# EAGLE design cm_AD8629 (EAGLE 8.5.0)

## Sheet 1 of 2
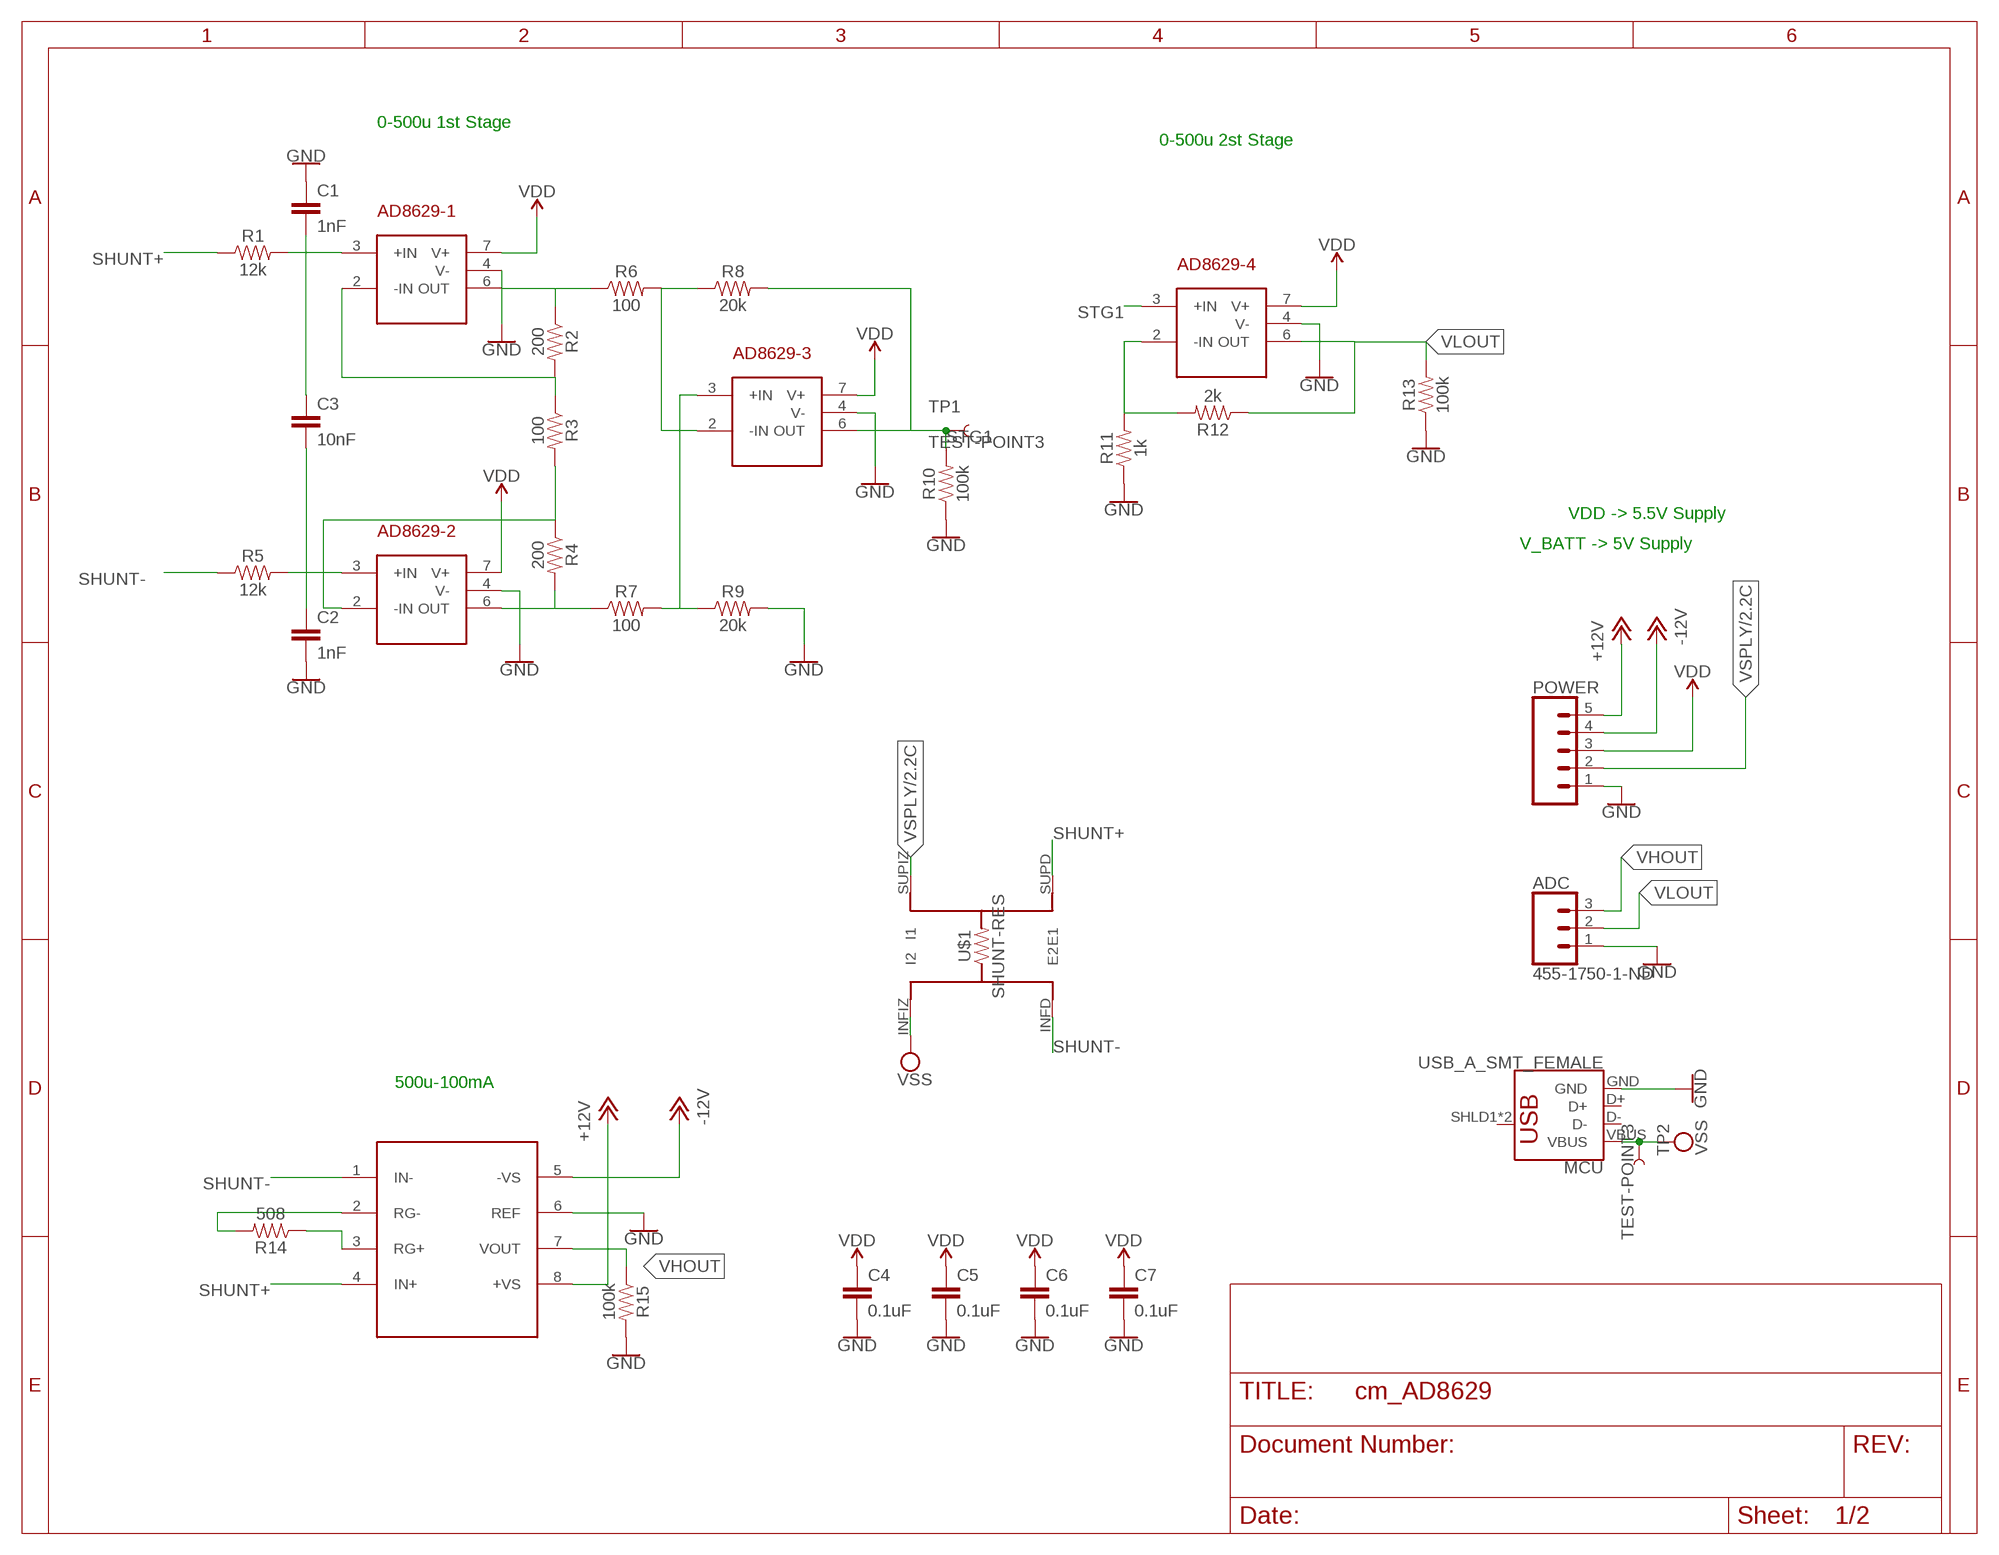
[diagram p0: schematic, sheet 1, part 1 of 2]
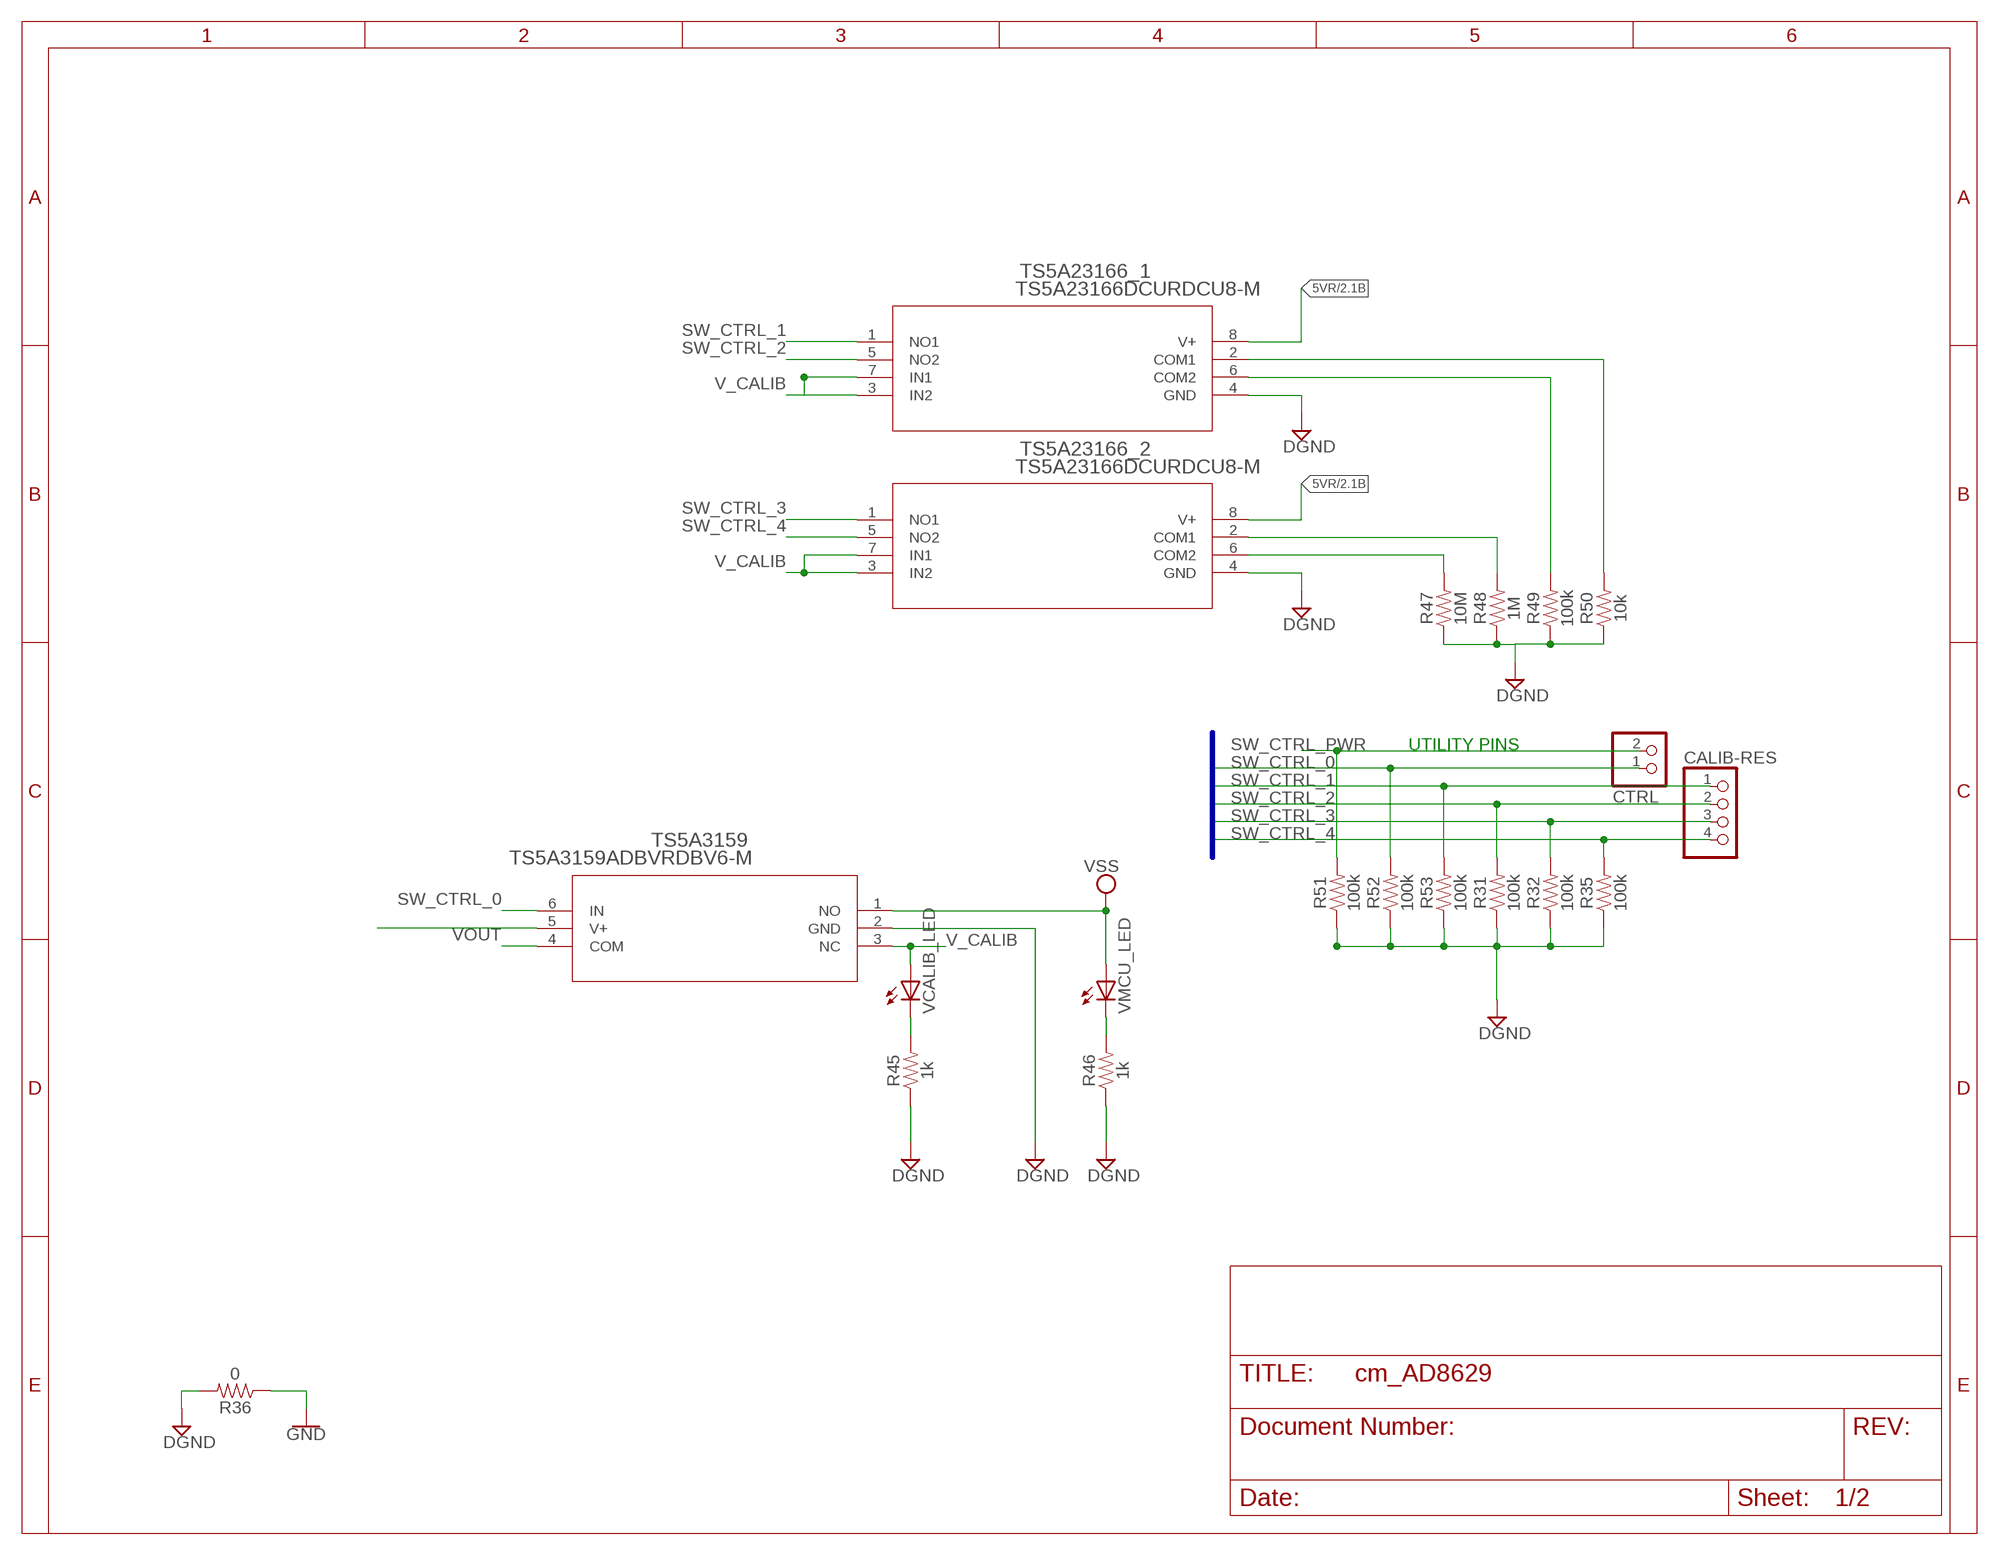
[diagram p1: schematic, sheet 1, part 2 of 2]

### Parts
AD8422  AD8422  [SO08]
AD8629-1  AD8629  [SO08]
AD8629-2  AD8629  [SO08]
AD8629-3  AD8629  [SO08]
AD8629-4  AD8629  [SO08]
ADC  455-1750-1-ND  CONN_03  [1X03]
C1  1nF  3.0NF-0603-50V-5%  [0603]
C2  1nF  3.0NF-0603-50V-5%  [0603]
C3  10nF  3.0NF-0603-50V-5%  [0603]
C4  0.1uF  3.0NF-0603-50V-5%  [0603]
C5  0.1uF  3.0NF-0603-50V-5%  [0603]
C6  0.1uF  3.0NF-0603-50V-5%  [0603]
C7  0.1uF  3.0NF-0603-50V-5%  [0603]
CALIB-RES  PINHD-1X4  [1X04]
CTRL  PINHD-1X2  [1X02]
MCU  USB_A_SMT_FEMALE  [USB-A-S-SILK-FEMALE]
POWER  CONN_05  [1X05]
R1  12k  8.2KOHM-0603-1/10W-5%  [0603]
R2  200  8.2KOHM-0603-1/10W-5%  [0603]
R3  100  8.2KOHM-0603-1/10W-5%  [0603]
R4  200  8.2KOHM-0603-1/10W-5%  [0603]
R5  12k  8.2KOHM-0603-1/10W-5%  [0603]
R6  100  8.2KOHM-0603-1/10W-5%  [0603]
R7  100  8.2KOHM-0603-1/10W-5%  [0603]
R8  20k  8.2KOHM-0603-1/10W-5%  [0603]
R9  20k  8.2KOHM-0603-1/10W-5%  [0603]
R10  100k  8.2KOHM-0603-1/10W-5%  [0603]
R11  1k  8.2KOHM-0603-1/10W-5%  [0603]
R12  2k  8.2KOHM-0603-1/10W-5%  [0603]
R13  100k  8.2KOHM-0603-1/10W-5%  [0603]
R14  508  8.2KOHM-0603-1/10W-5%  [0603]
R15  100k  8.2KOHM-0603-1/10W-5%  [0603]
R31  100k  8.2KOHM-0603-1/10W-5%  [0603]
R32  100k  8.2KOHM-0603-1/10W-5%  [0603]
R35  100k  8.2KOHM-0603-1/10W-5%  [0603]
R36  0  8.2KOHM-0603-1/10W-5%  [0603]
R45  1k  8.2KOHM-0603-1/10W-5%  [0603]
R46  1k  8.2KOHM-0603-1/10W-5%  [0603]
R47  10M  8.2KOHM-0603-1/10W-5%  [0603]
R48  1M  8.2KOHM-0603-1/10W-5%  [0603]
R49  100k  8.2KOHM-0603-1/10W-5%  [0603]
R50  10k  8.2KOHM-0603-1/10W-5%  [0603]
R51  100k  8.2KOHM-0603-1/10W-5%  [0603]
R52  100k  8.2KOHM-0603-1/10W-5%  [0603]
R53  100k  8.2KOHM-0603-1/10W-5%  [0603]
TP1  TEST-POINT3  [PAD.03X.03]
TP2  TEST-POINT3  [PAD.03X.03]
TS5A3159  TS5A3159ADBVRDBV6-M  [DBV6-M]
TS5A23166_1  TS5A23166DCURDCU8-M  [DCU8-M]
TS5A23166_2  TS5A23166DCURDCU8-M  [DCU8-M]
U$1  SHUNT-RES  [HIPREC-SMD-SHUNT]
VCALIB_LED  LEDCHIPLED_0603  [CHIPLED_0603]
VMCU_LED  LEDCHIPLED_0603  [CHIPLED_0603]

### Nets
5V_F: TS5A3159.5(V+)
5VR: TS5A23166_1.8(V+) TS5A23166_2.8(V+) ; also sheet 2
+12V: AD8422.8(+VS) POWER.5 ; also sheet 2
-12V: AD8422.5(-VS) POWER.4 ; also sheet 2
DGND: R31.1 R32.1 R35.1 R36.2 R45.1 R46.1 R47.1 R48.1 R49.1 R50.1 R51.1 R52.1 R53.1 TS5A3159.2(GND) TS5A23166_1.4(GND) TS5A23166_2.4(GND) ; also sheet 2
GND: AD8422.6(REF) AD8629-1.4(V-) AD8629-2.4(V-) AD8629-3.4(V-) AD8629-4.4(V-) ADC.1 C1.1 C2.2 C4.2 C5.2 C6.2 C7.2 MCU.GND POWER.1 R9.2 R10.1 R11.1 R13.1 R15.2 R36.1 ; also sheet 2
N$1: AD8629-2.3(+IN) C2.1 C3.2 R5.2
N$2: AD8629-1.6(OUT) R2.1 R6.1
N$3: AD8629-1.2(-IN) R2.2 R3.1
N$4: AD8629-2.2(-IN) R3.2 R4.1
N$5: AD8629-2.6(OUT) R4.2 R7.1
N$6: AD8629-1.3(+IN) C1.2 C3.1 R1.2
N$7: AD8422.2(RG-) R14.2
N$8: AD8629-3.2(-IN) R6.2 R8.1
N$9: AD8629-3.3(+IN) R7.2 R9.1
N$10: AD8422.3(RG+) R14.1
N$17: AD8629-4.2(-IN) R11.2 R12.2
N$23: R45.2 VCALIB_LED.C
N$24: R46.2 VMCU_LED.C
N$30: R50.2 TS5A23166_1.2(COM1)
N$31: R49.2 TS5A23166_1.6(COM2)
N$32: R48.2 TS5A23166_2.2(COM1)
N$33: R47.2 TS5A23166_2.6(COM2)
SHUNT+: AD8422.4(IN+) R1.1 U$1.SUPD(E1)
SHUNT-: AD8422.1(IN-) R5.1 U$1.INFD(E2)
STG1: AD8629-3.6(OUT) AD8629-4.3(+IN) R8.2 R10.2 TP1.P$1
SW_CTRL_0: CTRL.1 R52.2 TS5A3159.6(IN)
SW_CTRL_1: CALIB-RES.1 R53.2 TS5A23166_1.1(NO1)
SW_CTRL_2: CALIB-RES.2 R31.2 TS5A23166_1.5(NO2)
SW_CTRL_3: CALIB-RES.3 R32.2 TS5A23166_2.1(NO1)
SW_CTRL_4: CALIB-RES.4 R35.2 TS5A23166_2.5(NO2)
SW_CTRL_PWR: CTRL.2 R51.2 ; also sheet 2
V_CALIB: TS5A3159.3(NC) TS5A23166_1.3(IN2) TS5A23166_1.7(IN1) TS5A23166_2.3(IN2) TS5A23166_2.7(IN1) VCALIB_LED.A
VDD: AD8629-1.7(V+) AD8629-2.7(V+) AD8629-3.7(V+) AD8629-4.7(V+) C4.1 C5.1 C6.1 C7.1 POWER.3 ; also sheet 2
VHOUT: AD8422.7(VOUT) ADC.3 R15.1
VLOUT: AD8629-4.6(OUT) ADC.2 R12.1 R13.2
VOUT: TS5A3159.4(COM)
VSPLY: POWER.2 U$1.SUPIZ(I1) ; also sheet 2
VSS: MCU.VBUS TP2.P$1 TS5A3159.1(NO) U$1.INFIZ(I2) VMCU_LED.A
Unconnected: MCU.D+ MCU.D- MCU.SHLD1(SHIELD) MCU.SHLD2(SHIELD)

### Buses
SWITCH_CTRL_[1..6]

### Notes on the sheet
- 0-500u 1st Stage
- 0-500u 2st Stage
- VDD -> 5.5V Supply
- V_BATT -> 5V Supply
- UTILITY PINS
- 500u-100mA

## Sheet 2 of 2
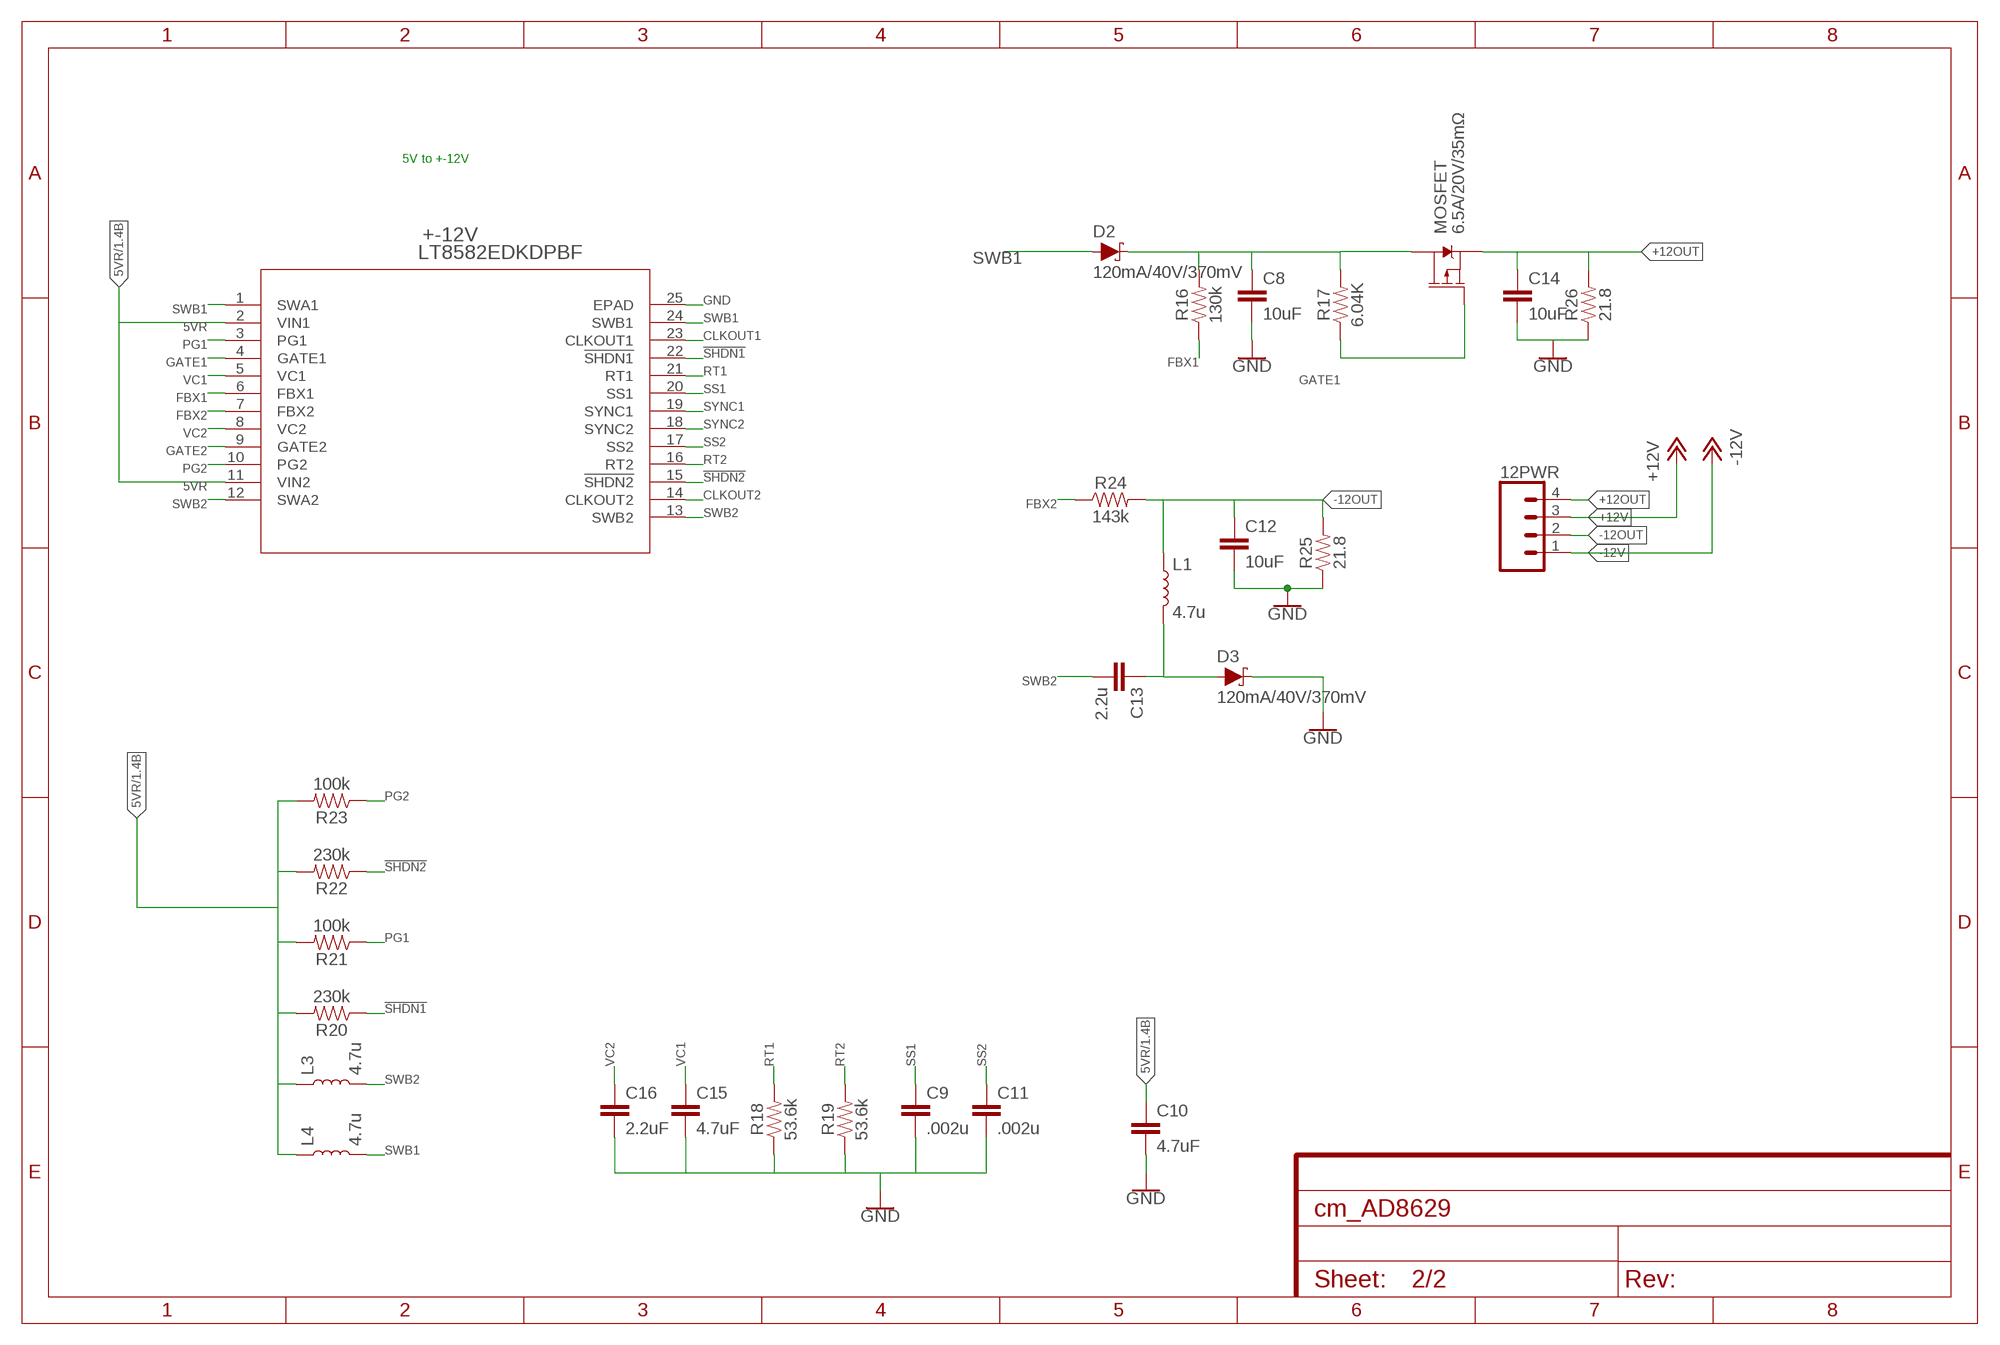
[diagram p2: schematic, sheet 2, part 1 of 2]
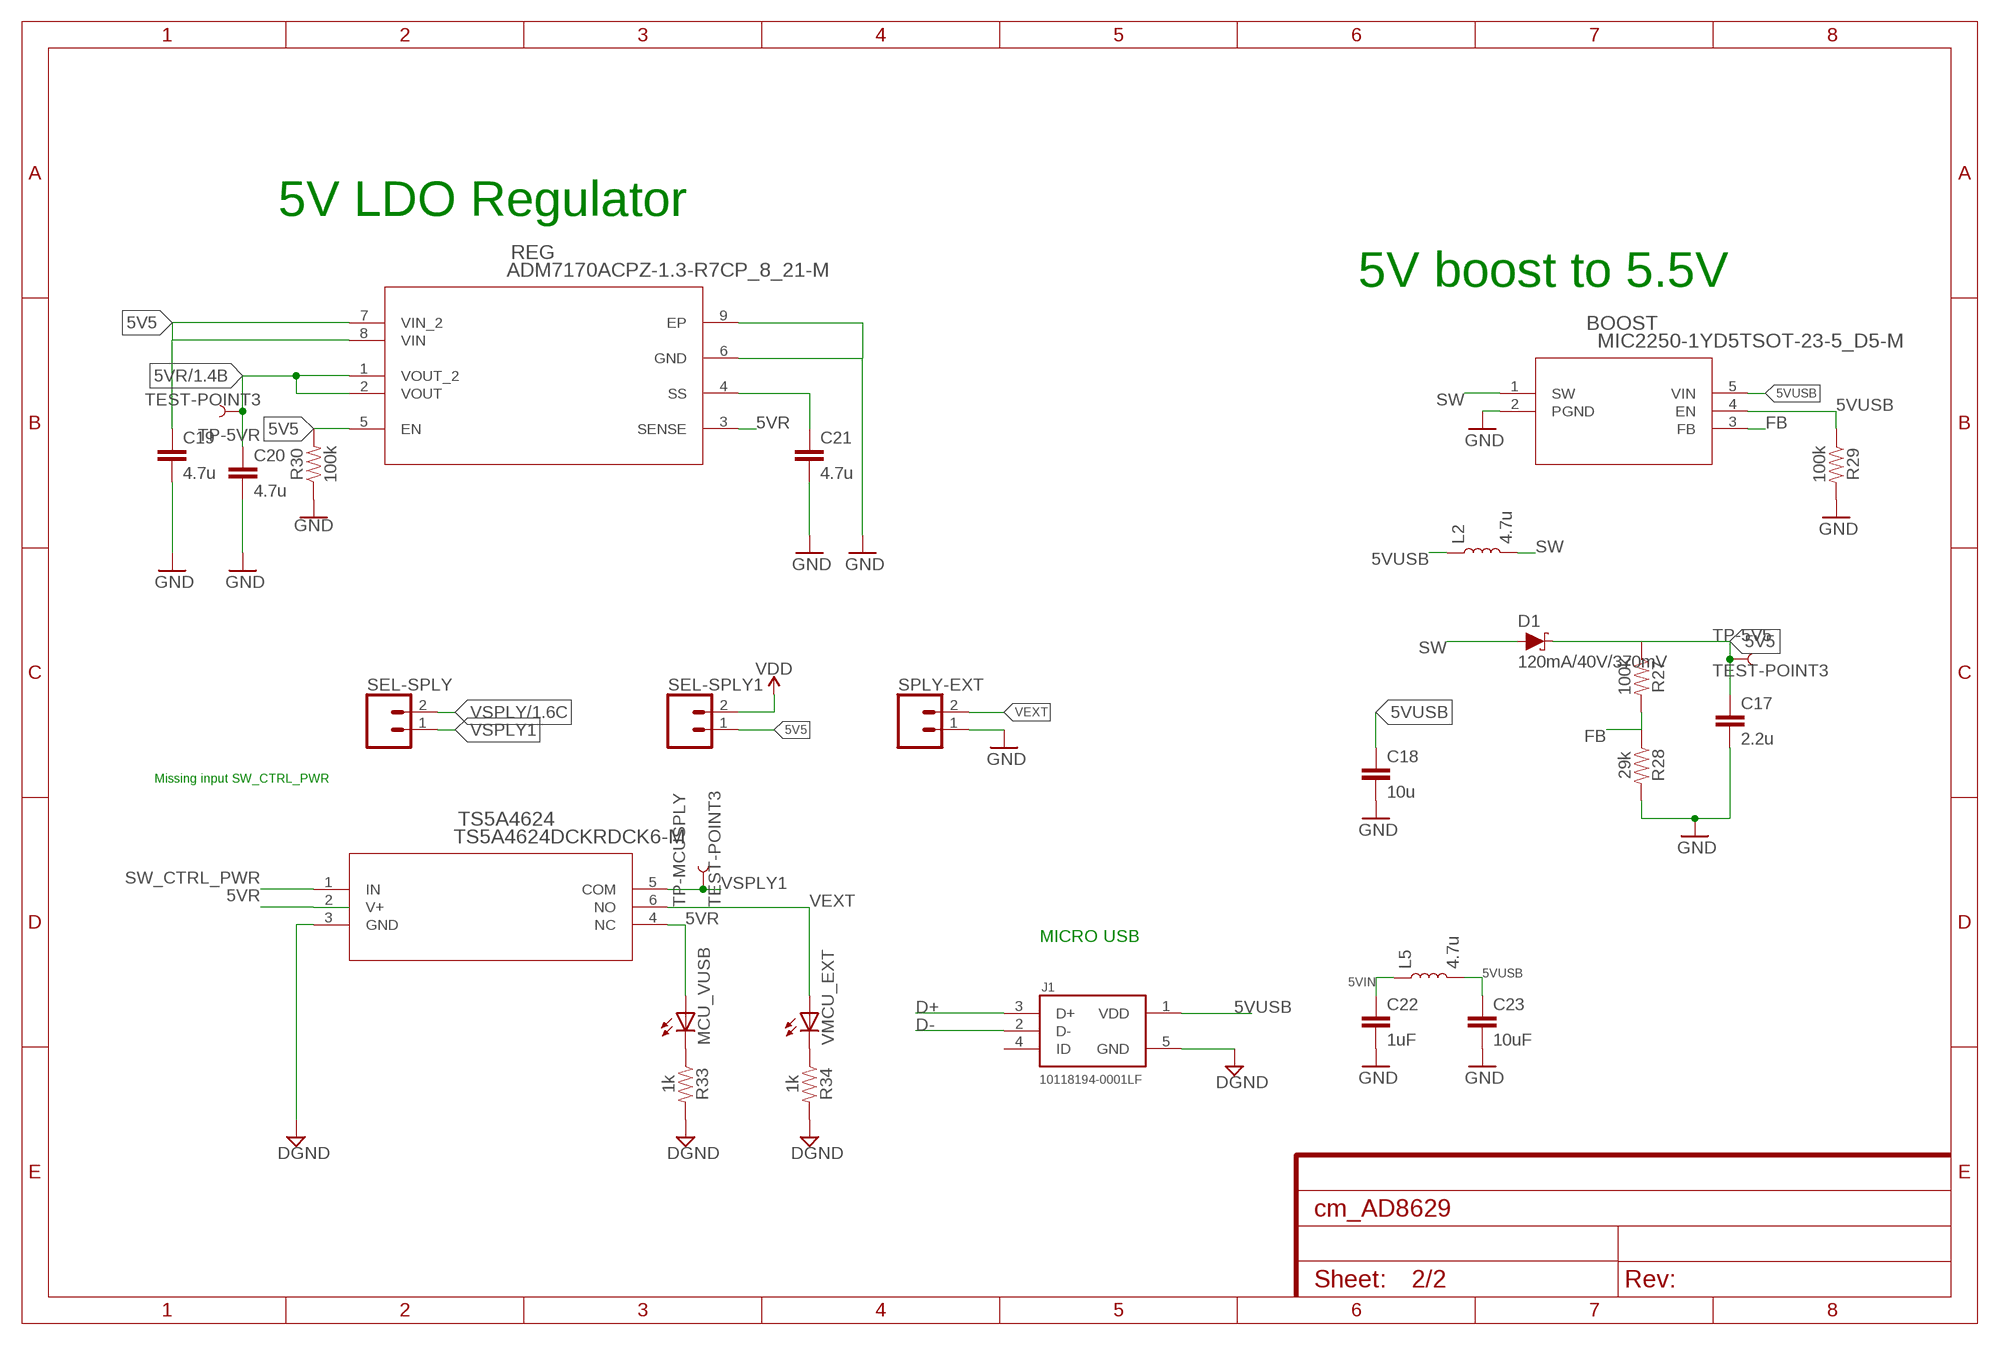
[diagram p3: schematic, sheet 2, part 2 of 2]

### Parts
12PWR  CONN_04  [1X04]
+-12V  LT8582EDKDPBF  [DFN-24_DKD]
BOOST  MIC2250-1YD5TSOT-23-5_D5-M  [TSOT-23-5_D5-M]
C8  10uF  10UF-0603-6.3V-20%  [0603]
C9  .002u  10UF-0603-6.3V-20%  [0603]
C10  4.7uF  10UF-0603-6.3V-20%  [0603]
C11  .002u  10UF-0603-6.3V-20%  [0603]
C12  10uF  10UF-0603-6.3V-20%  [0603]
C13  2.2u  10UF-0603-6.3V-20%  [0603]
C14  10uF  10UF-0603-6.3V-20%  [0603]
C15  4.7uF  10UF-0603-6.3V-20%  [0603]
C16  2.2uF  10UF-0603-6.3V-20%  [0603]
C17  2.2u  10UF-0603-6.3V-20%  [0603]
C18  10u  10UF-0603-6.3V-20%  [0603]
C19  4.7u  10UF-0603-6.3V-20%  [0603]
C20  4.7u  10UF-0603-6.3V-20%  [0603]
C21  4.7u  10UF-0603-6.3V-20%  [0603]
C22  1uF  10UF-0603-6.3V-20%  [0603]
C23  10uF  10UF-0603-6.3V-20%  [0603]
D1  120mA/40V/370mV  DIODE-SCHOTTKY-RB751S40  [SOD-523]
D2  120mA/40V/370mV  DIODE-SCHOTTKY-RB751S40  [SOD-523]
D3  120mA/40V/370mV  DIODE-SCHOTTKY-RB751S40  [SOD-523]
J1  10118194-0001LF  [FRAMATOME_10118194-0001LF]
L1  4.7u  1239AS-H  [252012C]
L2  4.7u  1239AS-H  [252012C]
L3  4.7u  1239AS-H  [252012C]
L4  4.7u  1239AS-H  [252012C]
L5  4.7u  1239AS-H  [252012C]
MCU_VUSB  LEDCHIPLED_0603  [CHIPLED_0603]
MOSFET  6.5A/20V/35mΩ  MOSFET_PCH-NDS8434  [SO08]
R16  130k  150KOHM-0603-1/10W-1%  [0603]
R17  6.04K  150KOHM-0603-1/10W-1%  [0603]
R18  53.6k  150KOHM-0603-1/10W-1%  [0603]
R19  53.6k  150KOHM-0603-1/10W-1%  [0603]
R20  230k  150KOHM-0603-1/10W-1%  [0603]
R21  100k  150KOHM-0603-1/10W-1%  [0603]
R22  230k  150KOHM-0603-1/10W-1%  [0603]
R23  100k  150KOHM-0603-1/10W-1%  [0603]
R24  143k  150KOHM-0603-1/10W-1%  [0603]
R25  21.8  150KOHM-0603-1/10W-1%  [0603]
R26  21.8  150KOHM-0603-1/10W-1%  [0603]
R27  100k  150KOHM-0603-1/10W-1%  [0603]
R28  29k  150KOHM-0603-1/10W-1%  [0603]
R29  100k  150KOHM-0603-1/10W-1%  [0603]
R30  100k  150KOHM-0603-1/10W-1%  [0603]
R33  1k  150KOHM-0603-1/10W-1%  [0603]
R34  1k  150KOHM-0603-1/10W-1%  [0603]
REG  ADM7170ACPZ-1.3-R7CP_8_21-M  [CP_8_21-M]
SEL-SPLY  CONN_02  [1X02]
SEL-SPLY1  CONN_02  [1X02]
SPLY-EXT  CONN_02  [1X02]
TP-5V5  TEST-POINT3  [PAD.03X.03]
TP-5VR  TEST-POINT3  [PAD.03X.03]
TP-MCUSPLY  TEST-POINT3  [PAD.03X.03]
TS5A4624  TS5A4624DCKRDCK6-M  [DCK6-M]
VMCU_EXT  LEDCHIPLED_0603  [CHIPLED_0603]

### Nets
5V5: C17.1 C19.1 D1.C R27.1 R30.2 REG.5(EN) REG.7(VIN_2) REG.8(VIN) SEL-SPLY1.1 TP-5V5.P$1
5VIN: C22.1 L5.1
5VR: +-12V.2(VIN1) +-12V.11(VIN2) C10.1 C20.1 L3.1 L4.1 MCU_VUSB.A R20.2 R21.2 R22.2 R23.2 REG.1(VOUT_2) REG.2(VOUT) REG.3(SENSE) TP-5VR.P$1 TS5A4624.2(V+) TS5A4624.4(NC) ; also sheet 1
5VUSB: BOOST.4(EN) BOOST.5(VIN) C18.1 C23.1 J1.1(VDD) L2.1 L5.2 R29.1
!SHDN1: +-12V.22(!SHDN1) R20.1
!SHDN2: +-12V.15(!SHDN2) R22.1
+12OUT: 12PWR.4 C14.1 MOSFET.1(S) MOSFET.2(S) MOSFET.3(S) R26.2
+12V: 12PWR.3 ; also sheet 1
-12OUT: 12PWR.2 C12.1 L1.1 R24.2 R25.2
-12V: 12PWR.1 ; also sheet 1
CLKOUT1: +-12V.23(CLKOUT1)
CLKOUT2: +-12V.14(CLKOUT2)
D+: J1.3(D+)
D-: J1.2(D-)
DGND: J1.5(GND) R33.2 R34.2 TS5A4624.3(GND) ; also sheet 1
FB: BOOST.3(FB) R27.2 R28.1
FBX1: +-12V.6(FBX1) R16.1
FBX2: +-12V.7(FBX2) R24.1
GATE1: +-12V.4(GATE1) MOSFET.4(G) R17.1
GATE2: +-12V.9(GATE2)
GND: +-12V.25(EPAD) BOOST.2(PGND) C8.2 C9.2 C10.2 C11.2 C12.2 C14.2 C15.2 C16.2 C17.2 C18.2 C19.2 C20.2 C21.2 C22.2 C23.2 D3.C R18.1 R19.1 R25.1 R26.1 R28.2 R29.2 R30.1 REG.6(GND) REG.9(EP) SPLY-EXT.1 ; also sheet 1
N$12: MCU_VUSB.C R33.1
N$13: C8.1 D2.C MOSFET.5(D) MOSFET.6(D) MOSFET.7(D) MOSFET.8(D) R16.2 R17.2
N$14: C13.1 D3.A L1.2
N$19: R34.1 VMCU_EXT.C
N$20: C21.1 REG.4(SS)
PG1: +-12V.3(PG1) R21.1
PG2: +-12V.10(PG2) R23.1
RT1: +-12V.21(RT1) R18.2
RT2: +-12V.16(RT2) R19.2
SS1: +-12V.20(SS1) C9.1
SS2: +-12V.17(SS2) C11.1
SW: BOOST.1(SW) D1.A L2.2
SW_CTRL_PWR: TS5A4624.1(IN) ; also sheet 1
SWB1: +-12V.1(SWA1) +-12V.24(SWB1) D2.A L4.2
SWB2: +-12V.12(SWA2) +-12V.13(SWB2) C13.2 L3.2
SYNC1: +-12V.19(SYNC1)
SYNC2: +-12V.18(SYNC2)
VC1: +-12V.5(VC1) C15.1
VC2: +-12V.8(VC2) C16.1
VDD: SEL-SPLY1.2 ; also sheet 1
VEXT: SPLY-EXT.2 TS5A4624.6(NO) VMCU_EXT.A
VSPLY: SEL-SPLY.2 ; also sheet 1
VSPLY1: SEL-SPLY.1 TP-MCUSPLY.P$1 TS5A4624.5(COM)
Unconnected: J1.4(ID)

### Notes on the sheet
- 5V to +-12V
- 5V LDO Regulator
- 5V boost to 5.5V
- Missing input SW_CTRL_PWR
- MICRO USB

## Library data of the parts
12PWR = SparkFun-Connectors:CONN_04: Multi connection point. Often used as Generic Header-pin footprint for 0.1 inch spaced/style header connections On any of the 0.1 inch spaced packages, you can populate with these: Break Away Headers - Straight <https://www.sparkfun.com/products/116> (PRT-00116) Break Away Male Headers - Right Angle <https://www.sparkfun.com/products/553> (PRT-00553) Female Headers <https://www.sparkfun.com/products/115> (PRT-00115) Break Away Headers - Machine Pin <https://www.sparkfun.com/products/117> (PRT-00117) Break Away Female Headers - Swiss Machine Pin <https://www.sparkfun.com/products/743> (PRT-00743) For SCREWTERMINALS and SPRING TERMINALS visit here: Screw Terimnals on SparkFun.com <https://www.sparkfun.com/search/results?term=Screw+Terminals> (5mm/3.5mm/2.54mm spacing) This device is also useful as a general connection point to wire up your design to another part of your project. Our various solder wires solder well into these plated through hole pads. Hook-Up Wire - Assortment (Stranded, 22 AWG) <https://www.sparkfun.com/products/11375> (PRT-11375) Hook-Up Wire - Assortment (Solid Core, 22 AWG) <https://www.sparkfun.com/products/11367> (PRT-11367) View the entire wire category on our website here <https://www.sparkfun.com/categories/141> Special notes: Molex polarized connector foot print use with SKU : PRT-08231 with associated crimp pins and housings. 1MM SMD Version SKU: PRT-10208; PROD_ID: CONN-09696
+-12V = LT8582:LT8582EDKDPBF; MANUFACTURER_PART_NUMBER: LT8582EDKD#PBF; VENDOR: Linear Technology
AD8422 = SparkFun-IC-Amplifiers:AD8422
AD8629-1-AD8629-4 = SparkFun-IC-Amplifiers:AD8629: Zero-Drift, Rail-to-Rail opamp
ADC = SparkFun-Connectors:CONN_03: Multi connection point. Often used as Generic Header-pin footprint for 0.1 inch spaced/style header connections On any of the 0.1 inch spaced packages, you can populate with these: Break Away Headers - Straight <https://www.sparkfun.com/products/116> (PRT-00116) Break Away Male Headers - Right Angle <https://www.sparkfun.com/products/553> (PRT-00553) Female Headers <https://www.sparkfun.com/products/115> (PRT-00115) Break Away Headers - Machine Pin <https://www.sparkfun.com/products/117> (PRT-00117) Break Away Female Headers - Swiss Machine Pin <https://www.sparkfun.com/products/743> (PRT-00743) Stackable Header - 3 Pin (Female, 0.1") <https://www.sparkfun.com/products/13875> (PRT-13875) For SCREWTERMINALS and SPRING TERMINALS visit here: Screw Terimnals on SparkFun.com <https://www.sparkfun.com/search/results?term=Screw+Terminals> (5mm/3.5mm/2.54mm spacing) This device is also useful as a general connection point to wire up your design to another part of your project. Our various solder wires solder well into these plated through hole pads. Hook-Up Wire - Assortment (Stranded, 22 AWG) <https://www.sparkfun.com/products/11375> (PRT-11375) Hook-Up Wire - Assortment (Solid Core, 22 AWG) <https://www.sparkfun.com/products/11367> (PRT-11367) View the entire wire category on our website here <https://www.sparkfun.com/categories/141> Special notes: Molex polarized connector foot print use with SKU : PRT-08232 with associated crimp pins and housings.; PROD_ID: XXX-00000
BOOST = texas_instruments:MIC2250-1YD5; MANUFACTURER_PART_NUMBER: MIC22501YD5; VENDOR: Micrel
C1-C7 = SparkFun-Capacitors:3.0NF: 3.0nF (3nF, 3000pF) ceramic capacitors A capacitor is a passive two-terminal electrical component used to store electrical energy temporarily in an electric field.; PROD_ID: CAP-13515; VALUE: 3.0nF
C8 C12 C14 C23 = SparkFun-Capacitors:10UF: 10.0µF ceramic capacitors A capacitor is a passive two-terminal electrical component used to store electrical energy temporarily in an electric field.; PROD_ID: CAP-11015
C9-C11 C13 C15-C22 = SparkFun-Capacitors:10UF: 10.0µF ceramic capacitors A capacitor is a passive two-terminal electrical component used to store electrical energy temporarily in an electric field.; PROD_ID: CAP-11015; VALUE: 10uF
CALIB-RES = pinhead:PINHD-1X4: PIN HEADER
CTRL = pinhead:PINHD-1X2: PIN HEADER
D1-D3 = SparkFun-DiscreteSemi:DIODE-SCHOTTKY: Schottky diode A Schottky diode is a semiconductor diode which has a low forward voltage drop and a very fast switching action.; PROD_ID: DIO-11018
J1 = 10118194-0001LF:10118194-0001LF: Conn Micro USB Type B RCP 5 POS 0.65mm Solder RA SMD 5 Terminal 1 Port T/R; AVAILABILITY: Good; DESCRIPTION: Conn Micro USB Type B RCP 5 POS 0.65mm Solder RA SMD 5 Terminal 1 Port T/R; MF: Amphenol; MP: 10118194-0001LF; PACKAGE: DIP-4 FCI; PRICE: 0.24 USD
L1-L5 = SparkFun-Coils:1239AS-H
MCU = SparkFun-Connectors:USB_A: USB-A Connector Male and female variants, as well as PTH and SMT variants SparkFun Products: SparkFun XBee Explorer Dongle <https://www.sparkfun.com/products/11697> PTH Male SparkFun MicroView-USB Programmer <https://www.sparkfun.com/products/12924> SMT Male SparkFun USB Type A Female Breakout <https://www.sparkfun.com/products/12700> SMT Female; PROD_ID: CONN-09520; SF_ID: PRT-09011
MCU_VUSB VCALIB_LED VMCU_EXT VMCU_LED = led:LED: LED OSRAM: - CHIPLED LG R971, LG N971, LY N971, LG Q971, LY Q971, LO R971, LY R971 LH N974, LH R974 LS Q976, LO Q976, LY Q976 LO Q996 - Hyper CHIPLED LW Q18S LB Q993, LB Q99A, LB R99A - SideLED LS A670, LO A670, LY A670, LG A670, LP A670 LB A673, LV A673, LT A673, LW A673 LH A674 LY A675 LS A676, LA A676, LO A676, LY A676, LW A676 LS A679, LY A679, LG A679 - Hyper Micro SIDELED® LS Y876, LA Y876, LO Y876, LY Y876 LT Y87S - SmartLED LW L88C, LW L88S LB L89C, LB L89S, LG L890 LS L89K, LO L89K, LY L89K LS L896, LA L896, LO L896, LY L896 - TOPLED LS T670, LO T670, LY T670, LG T670, LP T670 LSG T670, LSP T670, LSY T670, LOP T670, LYG T670 LG T671, LOG T671, LSG T671 LB T673, LV T673, LT T673, LW T673 LH T674 LS T676, LA T676, LO T676, LY T676, LB T676, LH T676, LSB T676, LW T676 LB T67C, LV T67C, LT T67C, LS T67K, LO T67K, LY T67K, LW E67C LS E67B, LA E67B, LO E67B, LY E67B, LB E67C, LV E67C, LT E67C LW T67C LS T679, LY T679, LG T679 LS T770, LO T770, LY T770, LG T770, LP T770 LB T773, LV T773, LT T773, LW T773 LH T774 LS E675, LA E675, LY E675, LS T675 LS T776, LA T776, LO T776, LY T776, LB T776 LHGB T686 LT T68C, LB T68C - Hyper Mini TOPLED® LB M676 - Mini TOPLED Santana® LG M470 LS M47K, LO M47K, LY M47K Source: http://www.osram.convergy.de LUXEON: - LUMILED® LXK2-PW12-R00, LXK2-PW12-S00, LXK2-PW14-U00, LXK2-PW14-V00 LXK2-PM12-R00, LXK2-PM12-S00, LXK2-PM14-U00 LXK2-PE12-Q00, LXK2-PE12-R00, LXK2-PE12-S00, LXK2-PE14-T00, LXK2-PE14-U00 LXK2-PB12-K00, LXK2-PB12-L00, LXK2-PB12-M00, LXK2-PB14-N00, LXK2-PB14-P00, LXK2-PB14-Q00 LXK2-PR12-L00, LXK2-PR12-M00, LXK2-PR14-Q00, LXK2-PR14-R00 LXK2-PD12-Q00, LXK2-PD12-R00, LXK2-PD12-S00 LXK2-PH12-R00, LXK2-PH12-S00 LXK2-PL12-P00, LXK2-PL12-Q00, LXK2-PL12-R00 Source: www.luxeon.com KINGBRIGHT: KA-3528ASYC Source: www.kingbright.com
MOSFET = SparkFun-DiscreteSemi:MOSFET_PCH: P-channel MOSFETs Voltage controlled devices that allow control of high current outputs. SparkFun Products: SparkFun ESP32 Thing <https://www.sparkfun.com/products/13907> SparkFun ESP8266 Thing <https://www.sparkfun.com/products/13231>; PROD_ID: TRANS-08355
POWER = SparkFun-Connectors:CONN_05: Multi connection point. Often used as Generic Header-pin footprint for 0.1 inch spaced/style header connections On any of the 0.1 inch spaced packages, you can populate with these: Break Away Headers - Straight <https://www.sparkfun.com/products/116> (PRT-00116) Break Away Male Headers - Right Angle <https://www.sparkfun.com/products/553> (PRT-00553) Female Headers <https://www.sparkfun.com/products/115> (PRT-00115) Break Away Headers - Machine Pin <https://www.sparkfun.com/products/117> (PRT-00117) Break Away Female Headers - Swiss Machine Pin <https://www.sparkfun.com/products/743> (PRT-00743) For SCREWTERMINALS and SPRING TERMINALS visit here: Screw Terimnals on SparkFun.com <https://www.sparkfun.com/search/results?term=Screw+Terminals> (5mm/3.5mm/2.54mm spacing) This device is also useful as a general connection point to wire up your design to another part of your project. Our various solder wires solder well into these plated through hole pads. Hook-Up Wire - Assortment (Stranded, 22 AWG) <https://www.sparkfun.com/products/11375> (PRT-11375) Hook-Up Wire - Assortment (Solid Core, 22 AWG) <https://www.sparkfun.com/products/11367> (PRT-11367) View the entire wire category on our website here <https://www.sparkfun.com/categories/141> Special notes: Molex polarized connector foot print use with SKU : PRT-08231 with associated crimp pins and housings. 1MM SMD Version SKU: PRT-10208
R1-R15 R31 R32 R35 R36 R45-R53 = SparkFun-Resistors:8.2KOHM: 8.2kΩ resistor A resistor is a passive two-terminal electrical component that implements electrical resistance as a circuit element. Resistors act to reduce current flow, and, at the same time, act to lower voltage levels within circuits. - Wikipedia; PROD_ID: RES-10646; VALUE: 8.2k
R16-R30 R33 R34 = SparkFun-Resistors:150KOHM: 150kΩ resistor A resistor is a passive two-terminal electrical component that implements electrical resistance as a circuit element. Resistors act to reduce current flow, and, at the same time, act to lower voltage levels within circuits. - Wikipedia; PROD_ID: RES-09117; VALUE: 150k
REG = analog_devices:ADM7170ACPZ-1.3-R7; MANUFACTURER_PART_NUMBER: ADM7170ACPZ1.3R7; VENDOR: Analog Devices Inc
SEL-SPLY SEL-SPLY1 SPLY-EXT = SparkFun-Connectors:CONN_02: Multi connection point. Often used as Generic Header-pin footprint for 0.1 inch spaced/style header connections On any of the 0.1 inch spaced packages, you can populate with these: Break Away Headers - Straight <https://www.sparkfun.com/products/116> (PRT-00116) Break Away Male Headers - Right Angle <https://www.sparkfun.com/products/553> (PRT-00553) Female Headers <https://www.sparkfun.com/products/115> (PRT-00115) Break Away Headers - Machine Pin <https://www.sparkfun.com/products/117> (PRT-00117) Break Away Female Headers - Swiss Machine Pin <https://www.sparkfun.com/products/743> (PRT-00743) For SCREWTERMINALS and SPRING TERMINALS visit here: Screw Terimnals on SparkFun.com <https://www.sparkfun.com/search/results?term=Screw+Terminals> (5mm/3.5mm/2.54mm spacing) This device is also useful as a general connection point to wire up your design to another part of your project. Our various solder wires solder well into these plated through hole pads. Hook-Up Wire - Assortment (Stranded, 22 AWG) <https://www.sparkfun.com/products/11375> (PRT-11375) Hook-Up Wire - Assortment (Solid Core, 22 AWG) <https://www.sparkfun.com/products/11367> (PRT-11367) View the entire wire category on our website here <https://www.sparkfun.com/categories/141> Special notes: Molex polarized connector foot print use with: PRT-08233 with associated crimp pins and housings. 2.54_SCREWTERM for use with PRT-10571. 3.5mm Screw Terminal footprints for PRT-08084 5mm Screw Terminal footprints for use with PRT-08432
TP1 TP2 TP-5V5 TP-5VR TP-MCUSPLY = SparkFun-Connectors:TEST-POINT: SparkFun Test Points Bare copper test points for troubleshooting or In-Circuit-Testing. These are used by our Production team for verifying production board runs using pogo-pins on test beds. SparkFun Products: SparkFun LSM9DS1 Breakout <https://www.sparkfun.com/products/13284> SparkFun PSOC <https://www.sparkfun.com/products/13714> SparkFun Load Cell Amplifier <https://www.sparkfun.com/products/13879>
TS5A3159 = texas_instruments:TS5A3159ADBVR; MANUFACTURER_PART_NUMBER: TS5A3159ADBVR; VENDOR: Texas Instruments
TS5A4624 = texas_instruments:TS5A4624DCKR; MANUFACTURER_PART_NUMBER: TS5A4624DCKR; VENDOR: Texas Instruments
TS5A23166_1 TS5A23166_2 = texas_instruments:TS5A23166DCUR; MANUFACTURER_PART_NUMBER: TS5A23166DCUR; VENDOR: Texas Instruments
U$1 = SparkFun-Resistors:SHUNT-RES

## Board
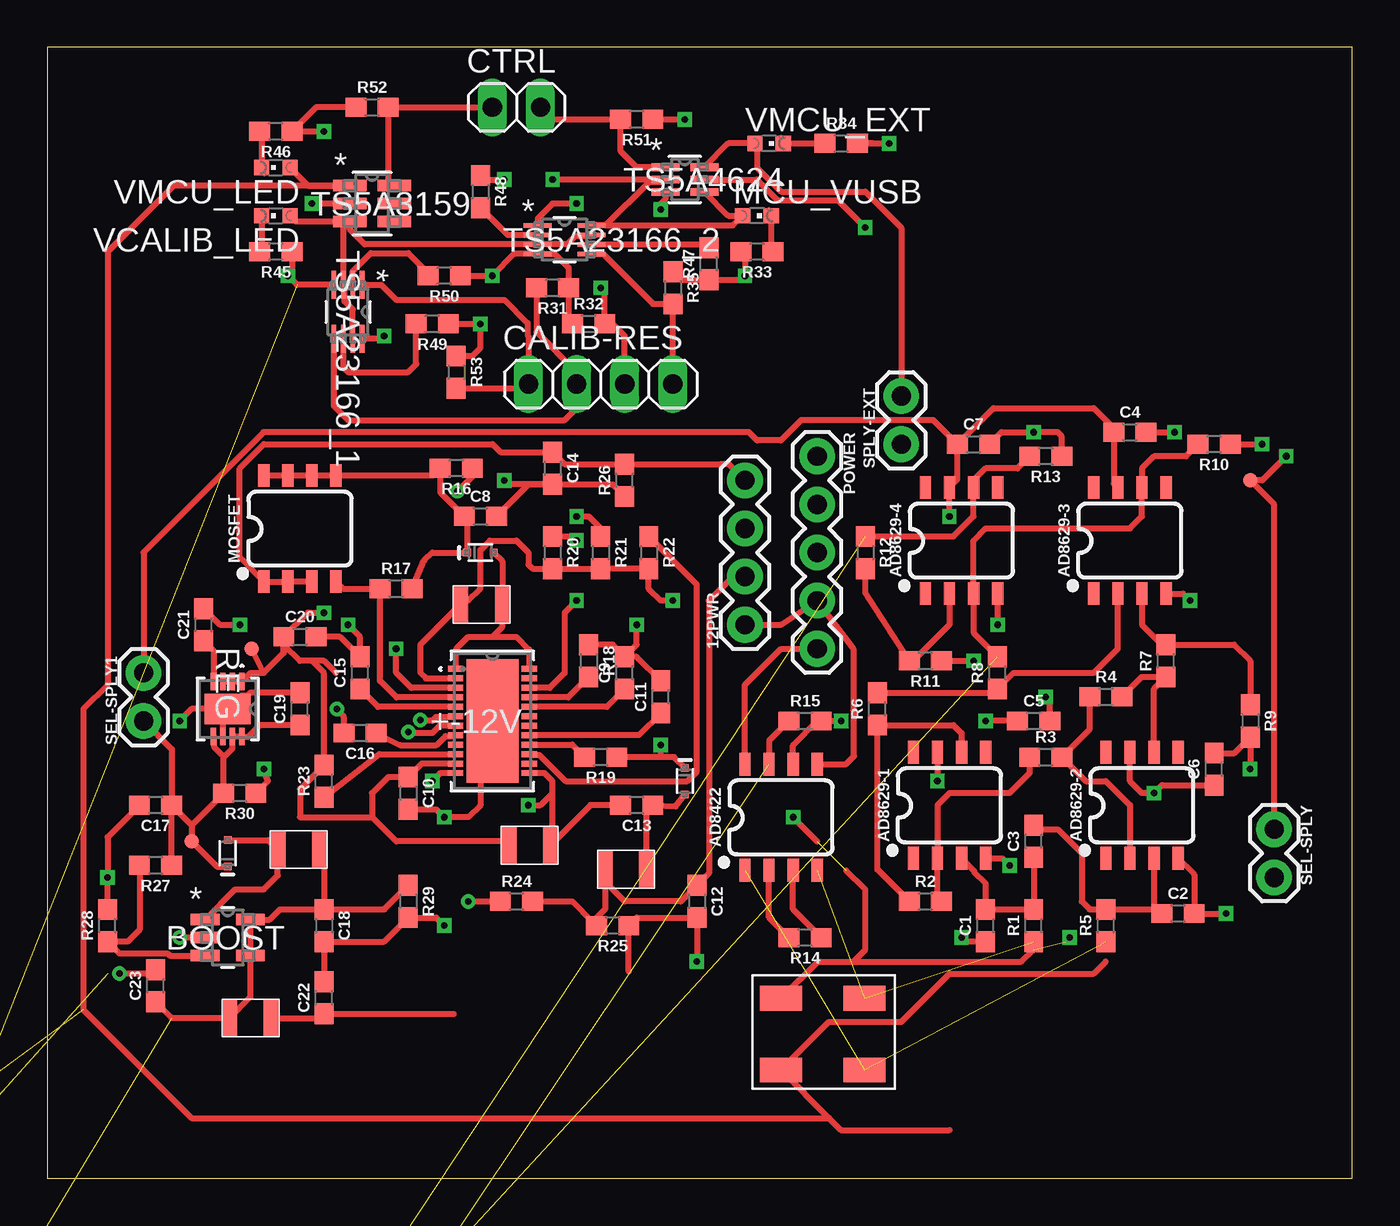
[diagram p4: board, top side]
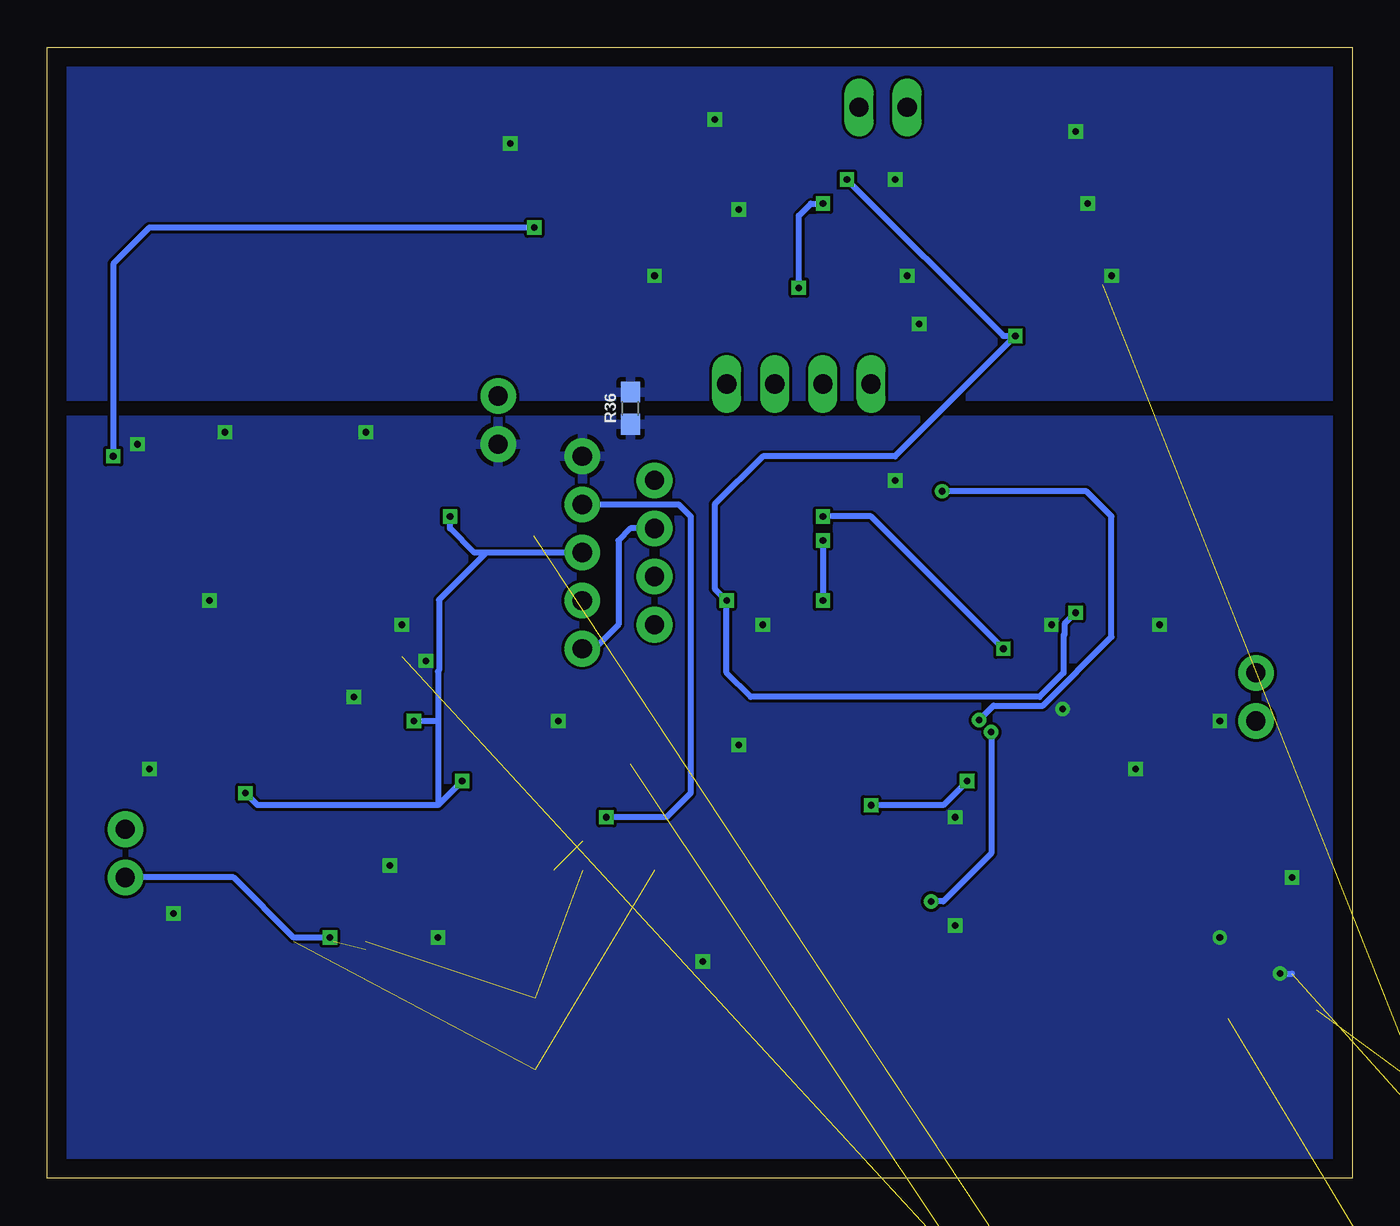
[diagram p5: board, bottom side, seen from below]

Size 68.89 x 59.68 mm. Coordinates in mm from the lower left corner, seen from the top.
Outline: 0,0 68.89,0 68.89,59.68 0,59.68 0,0
Copper layers (1*16): Top 0.035mm / dielectric 1.5mm / Bottom 0.035mm
Design rules "default": minimum track width 6mil, minimum drill 0.35mm, track to track 6mil, track to pad 6mil, pad to pad 6mil, via to via 6mil, smd to smd 6mil, copper to edge 40mil, drill to drill 6mil, minimum pad ring 10mil, minimum via ring 8mil, stop-mask expansion 4mil, vias tented up to drill 0mil, thermal gap 10mil

### Footprints (pad centres in the part's own frame; a part is rotated, then mirrored left to right if it is on the bottom)
1X04 = drill 1.016 pad 1.88: 1 0,0; 2 2.54,0; 3 5.08,0; 4 7.62,0
DFN-24_DKD = smd 0.813 x 0.305: 1 -1.943,2.75; 2 -1.943,2.25; 3 -1.943,1.75; 4 -1.943,1.25; 5 -1.943,0.75; 6 -1.943,0.25; 7 -1.943,-0.25; 8 -1.943,-0.75; 9 -1.943,-1.25; 10 -1.943,-1.75; 11 -1.943,-2.25; 12 -1.943,-2.75; 13 1.943,-2.75; 14 1.943,-2.25; 15 1.943,-1.75; 16 1.943,-1.25; 17 1.943,-0.75; 18 1.943,-0.25; 19 1.943,0.25; 20 1.943,0.75; 21 1.943,1.25; 22 1.943,1.75; 23 1.943,2.25; 24 1.943,2.75 | smd 2.74 x 6.53: 25 0,0
SO08 = smd 0.6 x 1.2: 1 -1.905,-2.8; 2 -0.635,-2.8; 3 0.635,-2.8; 4 1.905,-2.8; 5 1.905,2.8; 6 0.635,2.8; 7 -0.635,2.8; 8 -1.905,2.8
1X03 = drill 1.016 pad 1.88: 1 0,0; 2 2.54,0; 3 5.08,0
TSOT-23-5_D5-M = smd 1.524 x 0.61: 1 -1.194,0.95; 2 -1.194,0; 3 -1.194,-0.95; 4 1.194,-0.95; 5 1.194,0.95
0603 = smd 1.1 x 1: 1 -0.85,0; 2 0.85,0
1X04' = drill 1.016 long: 1 -3.81,0; 2 -1.27,0; 3 1.27,0; 4 3.81,0
1X02 = drill 1.016 long: 1 -1.27,0; 2 1.27,0
SOD-523 = smd 0.4 x 0.4: A -0.7,0; C 0.7,0
FRAMATOME_10118194-0001LF = smd 0.45 x 1.35: 1 -1.3,2.675; 2 -0.65,2.675; 3 0,2.675; 4 0.65,2.675; 5 1.3,2.675 | drill 0.9: P$6 -2.5,2.7; P$7 2.5,2.7 | drill 1.2: P$8 -3.5,0; P$9 3.5,0
252012C = smd 2 x 0.8: 1 0.2,-0.4; 2 0.2,1.8
USB-A-S-SILK-FEMALE = smd 3 x 0.9: D+ 7.212,-1; D- 7.212,1; GND 7.212,-3.5; VBUS 7.212,3.5 | drill 2.311: SHLD1 3,-6.566; SHLD2 3,6.566
CHIPLED_0603 = smd 0.8 x 0.8: A 0,-0.75; C 0,0.75
1X05 = drill 1.016 pad 1.88: 1 0,0; 2 2.54,0; 3 5.08,0; 4 7.62,0; 5 10.16,0
CP_8_21-M = smd 0.906 x 0.3: 1 -1.453,0.75; 2 -1.453,0.25; 3 -1.453,-0.25; 4 -1.453,-0.75; 5 1.453,-0.75; 6 1.453,-0.25; 7 1.453,0.25; 8 1.453,0.75 | smd 1.6 x 2.44: 9 0,0
1X02' = drill 1.016 pad 1.88: 1 0,0; 2 2.54,0
PAD.03X.03 = smd 0.762 x 0.762: P$1 0,0
DBV6-M = smd 1.778 x 0.61: 1 -1.168,0.95; 2 -1.168,0; 3 -1.168,-0.95; 4 1.168,-0.95; 5 1.168,0; 6 1.168,0.95
DCK6-M = smd 1.473 x 0.406: 1 -1.029,0.65; 2 -1.029,0; 3 -1.029,-0.65; 4 1.029,-0.65; 5 1.029,0; 6 1.029,0.65
DCU8-M = smd 1.473 x 0.254: 1 -1.422,0.75; 2 -1.422,0.25; 3 -1.422,-0.25; 4 -1.422,-0.75; 5 1.422,-0.75; 6 1.422,-0.25; 7 1.422,0.25; 8 1.422,0.75
HIPREC-SMD-SHUNT = smd 2.2 x 1.3: INFD 4.4,0; INFIZ 0,0; SUPD 4.4,3.78; SUPIZ 0,3.78

### Placement (x,y rotation side)
12PWR  36.83,29.21 90 top
+-12V  23.5,24.13 0 top
AD8422  38.73,19.05 0 top
AD8629-1  47.62,19.68 0 top
AD8629-2  57.78,19.68 0 top
AD8629-3  57.15,33.66 0 top
AD8629-4  48.26,33.66 0 top
ADC  4.45,-20.96 0 top  (outside the outline)
BOOST  9.53,12.7 0 top
C1  49.53,13.34 90 top
C2  59.69,13.97 0 top
C3  52.07,17.78 90 top
C4  57.15,39.37 0 top
C5  52.07,24.13 0 top
C6  61.59,21.59 90 top
C7  48.9,38.73 0 top
C8  22.86,34.92 0 top
C9  30.48,26.67 90 top
C10  19.05,20.32 270 top
C11  32.38,25.4 90 top
C12  34.29,14.61 270 top
C13  31.11,19.68 180 top
C14  26.67,37.46 270 top
C15  16.51,26.67 90 top
C16  16.51,23.49 180 top
C17  5.71,19.68 180 top
C18  14.61,13.34 270 top
C19  13.34,24.77 90 top
C20  13.34,28.57 0 top
C21  8.26,29.21 90 top
C22  14.61,9.53 90 top
C23  5.71,10.16 90 top
CALIB-RES  [1X04']  29.21,41.91 0 top
CTRL  24.77,56.52 0 top
D1  9.53,17.14 270 top
D2  22.86,33.02 180 top
D3  33.66,20.95 90 top
J1  -25.4,-49.53 0 top  (outside the outline)
L1  29.84,16.51 270 top
L2  13.97,17.14 90 top
L3  24.77,17.78 270 top
L4  22.23,30.48 270 top
L5  11.43,8.26 90 top
MCU  -24.77,-8.89 0 top  (outside the outline)
MCU_VUSB  37.47,50.8 270 top
MOSFET  13.34,34.29 0 top
POWER  40.64,38.1 270 top
R1  52.07,13.34 90 top
R2  46.35,14.61 0 top
R3  52.7,22.22 0 top
R4  55.88,25.4 0 top
R5  55.88,13.34 90 top
R6  43.81,24.77 90 top
R7  59.05,27.3 90 top
R8  50.16,26.67 90 top
R9  63.5,24.13 270 top
R10  61.59,38.73 180 top
R11  46.35,27.3 180 top
R12  43.18,33.02 270 top
R13  52.7,38.1 180 top
R14  40.01,12.7 180 top
R15  40.01,24.13 0 top
R16  21.59,37.46 180 top
R17  18.41,31.12 0 top
R18  28.57,27.3 270 top
R19  29.21,22.22 180 top
R20  26.67,33.02 270 top
R21  29.21,33.02 270 top
R22  31.75,33.02 270 top
R23  14.61,20.95 90 top
R24  24.77,14.61 0 top
R25  29.84,13.34 180 top
R26  30.48,36.83 90 top
R27  5.71,16.51 180 top
R28  3.17,13.34 90 top
R29  19.05,14.61 270 top
R30  10.16,20.32 180 top
R31  26.67,46.99 180 top
R32  28.57,45.09 0 top
R33  37.47,48.89 180 top
R34  41.91,54.61 0 top
R35  33.02,46.99 270 top
R36  38.1,40.64 90 bottom
R45  12.06,48.89 180 top
R46  12.06,55.24 180 top
R47  34.92,48.26 90 top
R48  22.86,52.07 270 top
R49  20.32,45.09 180 top
R50  20.95,47.62 180 top
R51  31.11,55.88 180 top
R52  17.14,56.52 0 top
R53  21.59,42.55 270 top
REG  9.53,24.77 270 top
SEL-SPLY  [1X02']  64.77,18.41 270 top
SEL-SPLY1  [1X02']  5.08,24.13 90 top
SPLY-EXT  [1X02']  45.09,38.73 90 top
TP1  -3.81,-31.12 0 top  (outside the outline)
TP2  -36.83,-33.02 0 top  (outside the outline)
TP-5V5  7.62,17.78 0 top
TP-5VR  10.79,27.94 0 top
TP-MCUSPLY  63.5,36.83 0 top
TS5A3159  17.14,51.44 0 top
TS5A4624  33.66,52.7 0 top
TS5A23166_1  15.88,45.72 270 top
TS5A23166_2  27.3,49.53 0 top
U$1  38.73,5.71 0 top
VCALIB_LED  12.06,50.8 90 top
VMCU_EXT  38.1,54.61 270 top
VMCU_LED  12.06,53.34 90 top

### Tracks (layer width: path | path; a pad name or v marks a point on that pad's centre or on a via)
5V5
  Top 0.305: R27.1 C17.1 | C17.1 7.62,18.63 | 7.62,18.63 R30.2 9.31,22.22 | 7.62,18.63 TP-5V5.P$1 8.96,16.45 D1.C | REG.5 8.82,23.27 8.82,22.73 9.31,22.24 9.31,22.22 | 9.31,22.22 9.78,22.69 REG.7 REG.8 10.31,23.28 10.58,23.28 11.21,23.91 C19.1 | SEL-SPLY1.1 6.57,22.64 C17.1
5VIN
  Top 0.305: L5.1 14.38,8.46 C22.1 21.46,8.68
5VR  (via drill 0.35)
  Top 0.305: +-12V.11 19.76,21.88 C10.1 18,21.17 17.14,20.32 17.14,19.05 | L3.1 24.16,17.78 18.41,17.78 17.14,19.05 | 15.24,26.67 14.61,27.3 13.97,27.3 | 13.97,27.3 13.34,27.3 12.48,28.15 C20.1 | REG.3 REG.2 REG.1 10.73,26.67 11.43,26.67 | 11.43,26.67 12.48,27.72 C20.1 | 11.43,26.67 TP-5VR.P$1 | +-12V.2 19.99,26.38 19.69,26.68 19.69,28.15 L4.1 22.02,30.48 22.23,30.48 22.86,31.12 22.86,33.15 23.36,33.66 24.77,33.66 25.4,33.02 25.4,32.38 25.61,32.17 R20.2 R21.2 R22.2 31.75,31.12 32.38,30.48 v33.02,30.48 | 17.14,19.05 13.34,19.05 13.34,20.54 R23.2 14.61,26.67 13.97,27.3 | 29.48,50.28 TS5A23166_2.8 | 29.48,50.28 31.76,52.56 32.48,52.56 TS5A4624.2 v26.67,52.7 | TS5A4624.4 35.94,50.8 MCU_VUSB.A 36.2,50.28 29.48,50.28 | v17.78,44.45 17.63,44.3 TS5A23166_1.8 | C20.1 13.76,29.84 v14.61,29.84
  Bottom 0.305: v26.67,52.7 18.41,44.45 v17.78,44.45 24.13,38.1 31.11,38.1 33.66,35.56 33.66,31.12 v33.02,30.48 33.02,26.67 31.75,25.4 16.51,25.4 15.24,26.67 15.24,28.66 15.19,28.71 15.19,29.26 v14.61,29.84
5VUSB  (1 unrouted)
  Top 0.305: C23.1 6.57,8.46 L5.2 10.72,9.54 BOOST.4 BOOST.5 11.74,13.65 12.28,14.19 C18.1 | C18.1 17.78,14.19 R29.1 | L2.1 14.61,17.11 C18.1
!SHDN1  (via drill 0.35)
  Top 0.305: R20.1 27.73,33.87 v27.94,33.66 | v27.94,30.48 27.3,29.84 27.3,26.67 26.52,25.88 +-12V.22
  Bottom 0.305: v27.94,33.66 v27.94,30.48
!SHDN2
  Top 0.305: R22.1 34.29,31.33 34.29,21.46 33.79,20.95 27.35,20.95 25.97,22.34 25.48,22.34 +-12V.15
+12OUT
  Top 0.305: MOSFET.3 MOSFET.2 MOSFET.1 10.16,32.76 10.16,37.46 11.43,38.73 23.5,38.73 23.91,38.31 C14.1 27.3,37.68 R26.2 35.56,37.68 35.98,37.68 12PWR.4
+12V
  Top 0.305: AD8422.8 36.83,26.04 38.73,27.94 POWER.5
  Bottom 0.305: POWER.5 40.01,27.94 38.73,29.21 38.73,33.66 38.1,34.29 12PWR.3
-12OUT
  Top 0.305: R24.2 27.73,14.61 28.79,13.54 | 28.79,13.54 R25.2 | 28.79,13.54 29.45,14.21 L1.1 29.45,15.64 30.48,14.61 33.44,14.61 C12.1 34.92,16.09 34.92,30.48 36.2,31.75 12PWR.2
-12V
  Top 0.305: AD8422.5 42.17,21.85 42.59,22.27 42.59,24.63 42.55,24.68 42.55,27.94 POWER.4 38.73,29.21 12PWR.1
DGND  (via drill 0.35)  (1 unrouted)
  Top 0.305: R50.1 v23.5,47.62 24.65,48.78 TS5A23166_2.4 26.79,48.78 27.52,48.05 R31.1 27.52,45.29 R32.1 | R49.1 v22.86,45.09 22.86,43.81 22.44,43.39 R53.1 | R48.1 23.07,52.7 v24.13,52.7 | R45.1 12.91,47.84 v12.7,47.62 13.18,47.14 TS5A23166_1.4 | R52.1 14.19,56.52 R46.1 v14.61,55.24 | TS5A3159.2 v13.97,51.44 | R51.1 v33.66,55.88 | 43.6,54.61 R34.2 v44.45,54.61 | R33.2 36.83,48.68 v36.83,47.62 36.62,47.41 R47.1 33.45,47.41 R35.1 | TS5A4624.3 32.63,51.68 32.38,51.44 v32.38,51.12
  pour Bottom: 0.64,41.27 0,59.69 69.22,59.69 69.85,41.27
FB
  Top 0.305: BOOST.3 6.46,11.75 6.34,11.87 3.79,11.87 R28.1 4.23,12.49 4.87,13.12 R27.2
FBX1  (via drill 0.35 pad 0.55)
  Top 0.305: +-12V.6 21.51,24.34 20.52,24.34 20.31,24.14 19.74,24.14 v19.7,24.18 | v21.65,36.25 22.44,37.05 R16.1
  Bottom 0.305: v19.7,24.18 18.93,24.94 16.32,24.94 12.7,28.56 12.7,34.92 14.03,36.25 v21.65,36.25
FBX2  (via drill 0.35 pad 0.55)
  Top 0.305: +-12V.7 20.7,23.88 20.32,23.49 19.1,23.49 v19.05,23.54 | v22.23,14.61 R24.1
  Bottom 0.305: v19.05,23.54 19.05,17.14 21.59,14.61 v22.23,14.61
GATE1
  Top 0.305: +-12V.4 18.43,25.38 17.57,26.25 R17.1 15.62,31.12 MOSFET.4
GND  (via drill 0.35, 0.35 pad 0.55)  (2 unrouted)
  Top 0.305: C23.2 5.5,10.79 v3.81,10.79 | BOOST.2 v6.99,12.7 | R28.2 v3.17,15.88 3.17,17.99 C17.2 | C22.2 C18.2 17.78,12.49 R29.2 20.54,13.76 v20.95,13.34 | C10.2 20.54,19.47 v20.95,19.05 22.23,19.05 22.86,19.68 22.86,23.49 +-12V.25 | C11.2 31.11,27.52 C9.2 | C9.2 29.84,28.15 R18.1 | C9.2 31.11,28.15 v31.11,29.21 | 9.74,24.98 REG.9 | C21.2 9.11,29.21 v10.16,29.21 | 30.7,10.91 R25.1 31.11,13.76 C12.2 v34.29,11.43 | D3.C 33.09,22.22 32.38,22.22 | 32.38,22.22 R19.1 | 32.38,22.22 v32.38,22.86 | R30.1 11.64,20.95 v11.43,21.59 | REG.6 9.28,24.38 8.89,24.77 REG.9 | REG.9 7.62,24.77 v6.99,24.13 | C20.2 15.46,28.57 C15.2 16.51,28.57 v15.88,29.21 | C8.2 25.4,36.62 C14.2 | C14.2 29.84,36.62 R26.1 | C14.2 24.34,36.62 v24.13,36.83 | AD8422.6 39.37,22.86 40.64,24.13 R15.2 v41.91,24.13 | C1.1 48.48,12.49 v48.26,12.7 | AD8629-1.4 50.42,16.88 v50.8,16.51 | AD8629-2.4 60.54,16.04 C2.2 v62.23,13.97 | AD8629-4.4 v50.16,29.21 | R11.1 v48.9,27.3 | AD8629-3.4 59.95,30.85 v60.33,30.48 | C7.2 50.38,39.37 v52.07,39.37 53.34,39.37 53.55,39.16 R13.1 | C4.2 v59.51,39.37 59.69,39.37 | R10.1 v64.14,38.73 | v63.5,21.59 R9.2 62.66,22.44 C6.2 | C5.2 52.92,25.18 v52.7,25.4 | C19.2 10.71,25.61 10.55,25.46 10.22,25.46 REG.9 | C16.2 15.66,24.34 15.24,24.77 v15.29,24.77
  Bottom 0.305: v3.81,10.79 3.17,10.79
  pour Bottom: 0,40 68.58,40 69.22,0 0.64,0
N$1
  Top 0.305: AD8629-2.3 58.42,14.39 C2.1 58.62,14.19 R5.2 55.03,14.19 54.61,14.61 54.61,17.14 53.34,18.41 52.28,18.41 C3.2
N$2
  Top 0.305: R2.1 43.81,16.29 R6.1 47.84,23.91 48.26,23.49 AD8629-1.6
N$3
  Top 0.305: R2.2 46.99,14.82 AD8629-1.2 46.99,19.68 47.62,20.32 50.8,20.32 51.85,21.38 R3.1
N$4
  Top 0.305: R4.1 55.03,23.7 R3.2 54.83,20.95 55.88,20.95 57.15,19.68 AD8629-2.2
N$5
  Top 0.305: AD8629-2.6 58.42,25.82 R7.1 57.78,26.45 R4.2
N$6
  Top 0.305: C3.1 R1.2 C1.2 49.53,15.55 48.92,16.16 48.92,16.22 AD8629-1.3
N$7
  Top 0.305: R14.2 38.1,13.76 AD8422.2
N$8
  Top 0.305: R6.2 49.96,25.61 R8.1 51.02,26.67 55.24,26.67 56.52,27.94 AD8629-3.2
N$9
  Top 0.305: AD8629-3.3 57.78,29.21 58.84,28.15 R7.2 62.65,28.15 63.5,27.3 R9.1
N$10
  Top 0.305: R14.1 39.37,14.19 AD8422.3
N$12
  Top 0.305: MCU_VUSB.C 38.22,48.99 R33.1
N$13
  Top 0.305: R17.2 19.9,32.6 20.32,33.02 D2.C 22.16,34.77 C8.1 20.74,36.2 R16.2 20.36,37.09 MOSFET.5 MOSFET.6 MOSFET.7 MOSFET.8
N$14
  Top 0.305: L1.2 31.64,19.36 C13.1 33.17,19.62 D3.A
N$17
  Top 0.305: R12.2 43.18,30.9 R11.2 45.72,27.3 47.62,29.21 AD8629-4.2
N$19
  Top 0.305: VMCU_EXT.C R34.1
N$20
  Top 0.305: C21.1 8.78,27.84 REG.4
N$23
  Top 0.305: VCALIB_LED.C 11.31,48.99 R45.2
N$24
  Top 0.305: R46.2 11.31,55.14 VMCU_LED.C
N$30
  Top 0.305: TS5A23166_1.2 16.12,47.88 17.07,48.82 19.05,48.82 20.11,47.77 R50.2
N$31
  Top 0.305: TS5A23166_1.6 15.62,42.8 15.88,42.55 19.05,42.55 19.47,42.96 R49.2
N$32
  Top 0.305: R48.2 24.3,49.78 TS5A23166_2.2
N$33
  Top 0.305: TS5A23166_2.6 34.76,49.28 R47.2
PG1  (via drill 0.35)
  Top 0.305: +-12V.3 19.2,25.88 18.41,26.67 v18.41,27.94 | v27.94,34.92 28.57,34.92 29.21,34.29 R21.1
  Bottom 0.305: v18.41,27.94 25.4,34.92 v27.94,34.92
PG2
  Top 0.305: R23.1 17.52,22.38 +-12V.10
RT1
  Top 0.305: R18.2 27.5,25.38 +-12V.21
RT2
  Top 0.305: +-12V.16 27.7,22.88 R19.2
SHUNT+  (2 unrouted)
SHUNT-  (2 unrouted)
SS1
  Top 0.305: C9.1 29.54,24.88 +-12V.20
SS2
  Top 0.305: C11.1 31.21,23.38 +-12V.17
STG1  (1 unrouted)
  Top 0.305: R8.2 48.9,28.79 AD8629-4.3 48.9,33.66 49.53,34.29 57.15,34.29 57.78,34.92 AD8629-3.6 57.78,37.46 58.42,38.1 60.11,38.1 R10.2
SW
  Top 0.305: D1.A 11.67,17.84 L2.2 12.17,15.98 11.43,15.24 9.92,15.24 BOOST.1
SW_CTRL_0
  Top 0.305: CTRL.1 R52.2 18,52.7 TS5A3159.6
SW_CTRL_1
  Top 0.305: TS5A23166_1.1 17.63,47.14 18.41,46.35 24.13,46.35 25.36,45.12 25.36,44.48 25.4,44.44 CALIB-RES.1 25.18,41.7 R53.2
SW_CTRL_2
  Top 0.305: R31.2 25.82,44.66 27.94,42.55 CALIB-RES.2 27.94,40.64 27.3,40 15.88,40 15.12,40.75 TS5A23166_1.5
SW_CTRL_3  (via drill 0.35)
  Top 0.305: CALIB-RES.3 30.48,44.45 29.84,45.09 R32.2 29.43,46.77 v29.21,46.99 | v27.94,51.44 26.67,51.44 25.88,50.65 TS5A23166_2.1
  Bottom 0.305: v29.21,46.99 29.21,50.8 28.57,51.44 v27.94,51.44
SW_CTRL_4
  Top 0.305: CALIB-RES.4 R35.2 31.96,46.14 29.32,48.78 TS5A23166_2.5
SW_CTRL_PWR
  Top 0.305: CTRL.2 26.67,55.88 R51.2 30.27,54.19 31.1,53.35 TS5A4624.1
SWB1
  Top 0.305: +-12V.1 21.59,26.92 21.59,27.94 22.23,28.57 23.5,28.57 | 23.5,28.57 24.02,29.11 L4.2 24.02,32.55 D2.A | 23.5,28.57 24.77,28.57 25.44,27.9 +-12V.24
SWB2  (via drill 0.35)
  Top 0.305: +-12V.13 26.25,21.38 26.67,20.95 26.67,20.32 | 26.67,20.32 26.67,17.68 L3.2 28.67,19.68 C13.2 | +-12V.12 20.75,21.38 v20.32,20.95 | v25.4,19.68 26.04,19.68 26.67,20.32
  Bottom 0.305: v20.32,20.95 21.59,19.68 v25.4,19.68
V_CALIB
  Top 0.305: TS5A23166_1.7 16.12,45.85 15.69,46.28 15.69,47.07 TS5A23166_1.3 15.62,50.13 TS5A3159.3 | TS5A3159.3 15.98,50.06 16.76,49.28 TS5A23166_2.3 27.43,49.28 27.86,49.71 28.66,49.71 TS5A23166_2.7 | TS5A3159.3 13.13,50.48 VCALIB_LED.A
VC1
  Top 0.305: C15.1 17.45,24.88 +-12V.5
VC2
  Top 0.305: C16.1 18.63,22.86 20.54,22.86 21.02,23.34 21.51,23.34 +-12V.8
VDD  (via drill 0.35)
  Top 0.305: C7.1 48.05,36.88 AD8629-4.7 v47.62,34.92 | AD8629-3.7 56.3,36.67 C4.1 56.3,39.59 55.24,40.64 49.95,40.64 C7.1 | AD8629-2.7 57.15,20.95 57.78,20.32 v58.42,20.32 58.84,20.74 C6.1 | AD8629-1.7 v46.99,20.95 | C5.1 v49.53,24.13 | C7.1 46.77,40 39.8,40 38.73,38.94 37.47,38.94 37.04,39.37 11.42,39.37 5.08,33.03 SEL-SPLY1.2
  Bottom 0.305: v46.99,20.95 48.26,19.68 | 48.26,19.68 57.78,19.68 v58.42,20.32 | POWER.3 45.72,33.02 | 45.72,33.02 46.35,33.02 47.62,34.29 v47.62,34.92 | 48.26,24.13 48.26,26.75 48.21,26.8 48.21,30.53 45.72,33.02 | 48.26,24.13 48.26,19.68 | v49.53,24.13 48.26,24.13
VEXT
  Top 0.305: TS5A4624.6 35.94,54.61 VMCU_EXT.A 37.47,54.49 37.47,53.34 38.73,52.07 43.18,52.07 45.09,50.16 SPLY-EXT.2
VHOUT  (1 unrouted)
  Top 0.305: R15.1 38.1,23.07 AD8422.7
VLOUT  (1 unrouted)
  Top 0.305: R13.2 51.22,37.46 49.53,37.46 48.9,36.83 AD8629-4.6 48.9,34.92 47.84,33.87 R12.1
VSPLY  (via drill 0.35)  (2 unrouted)
  Top 0.305: U$1.SUPIZ 40.67,11.43 42.55,11.43 | 42.55,11.43 43.18,12.07 43.18,15.24 42.17,16.25 | 42.55,11.43 51.44,11.43 52.07,12.07 | 53.76,12.49 v53.98,12.7 | v39.37,19.05 40.64,17.78
  Bottom 0.305: v53.98,12.7 55.88,12.7 59.05,15.88 SEL-SPLY.2 | POWER.2 35.56,35.56 34.92,34.92 34.92,20.32 36.2,19.05 v39.37,19.05
VSPLY1  (via drill 0.35)
  Top 0.305: TS5A4624.5 37.45,52.7 38.55,51.61 41.73,51.61 v43.18,50.16 | v65.41,38.1 64.14,36.83 TP-MCUSPLY.P$1 64.77,35.56 SEL-SPLY.1
  Bottom 0.305: v65.41,38.1 65.41,48.26 63.5,50.16 v43.18,50.16
VSS  (2 unrouted)
  Top 0.305: 55.88,11.43 55.24,10.79 47.62,10.79 45.09,8.26 41.27,8.26 U$1.INFIZ 41.27,3.17 | VMCU_LED.A 13.77,52.38 TS5A3159.1 6.67,52.38 3.17,48.89 3.17,26.04 1.91,24.77 1.91,8.89 7.62,3.17 41.27,3.17 | 41.27,3.17 41.91,2.54 47.62,2.54